# Altium schematic sheet U_LEDs_I2C_PORT.SchDoc
size Tabloid; DocumentNumber: 9; SheetNumber: 9; SheetTotal: 11; SheetName: LEDs and I2C exp. connector; Size: 11x17; Sheet_Name: LEDs and I2C exp. connector
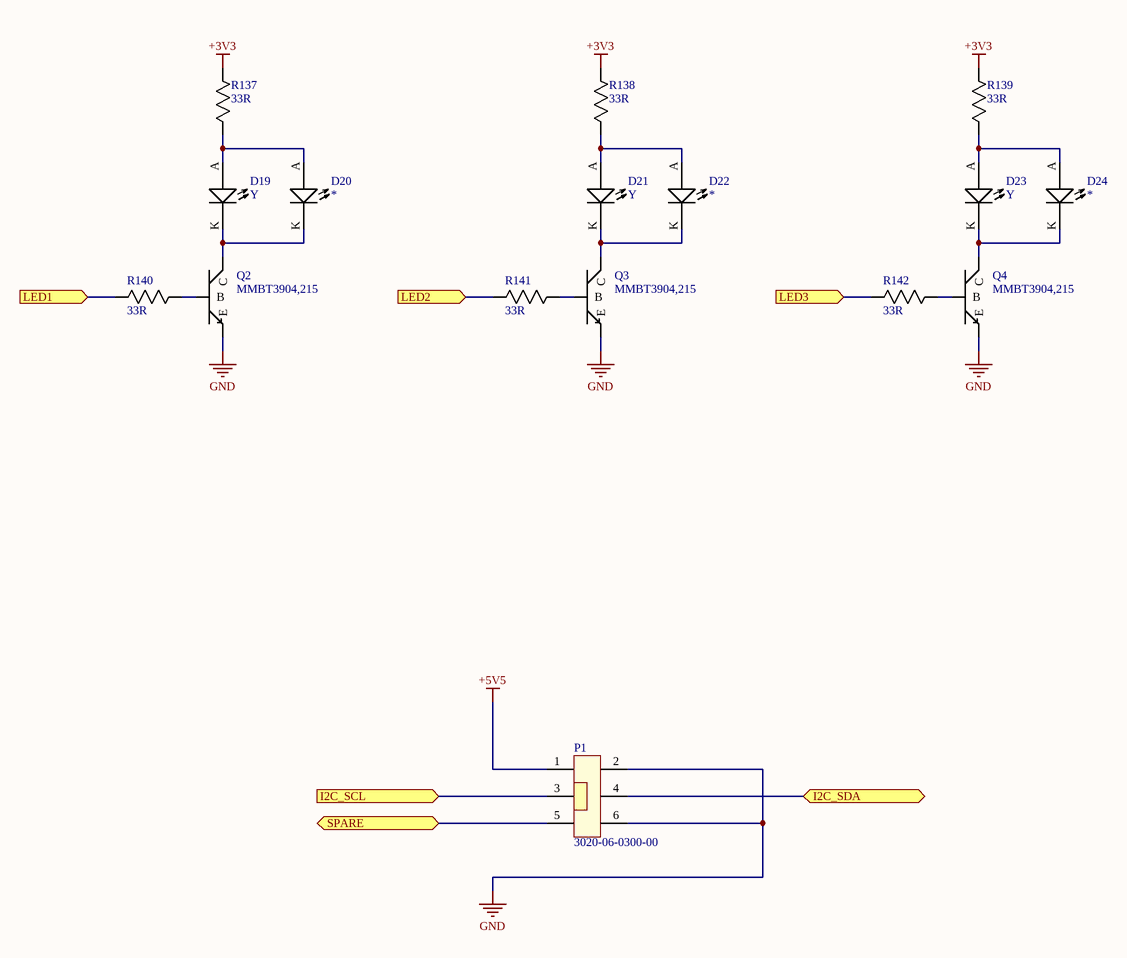
[diagram p0: U_LEDs_I2C_PORT.SchDoc]

## Parts
D19  Type: Y  [0805_LED]  (hidden comment: Diode_LED)
D20  Diode_LED  [0805_LED]  (value not drawn)
D21  Type: Y  [0805_LED]  (hidden comment: Diode_LED)
D22  Diode_LED  [0805_LED]  (value not drawn)
D23  Type: Y  [0805_LED]  (hidden comment: Diode_LED)
D24  Diode_LED  [0805_LED]  (value not drawn)
P1  Mfg_PN: 3020-06-0300-00  [CONN6_100mils_pol_SMD]  (hidden comment: CON6_3020-06-0300-00)
Q2  Mfg_PN: MMBT3904,215  [SOT23_GDS]  (hidden comment: BJT_N_GDS)
Q3  Mfg_PN: MMBT3904,215  [SOT23_GDS]  (hidden comment: BJT_N_GDS)
Q4  Mfg_PN: MMBT3904,215  [SOT23_GDS]  (hidden comment: BJT_N_GDS)
R137  value 33R  [0603]  (hidden comment: Resistor)
R138  value 33R  [0603]  (hidden comment: Resistor)
R139  value 33R  [0603]  (hidden comment: Resistor)
R140  value 33R  [0603]  (hidden comment: Resistor)
R141  value 33R  [0603]  (hidden comment: Resistor)
R142  value 33R  [0603]  (hidden comment: Resistor)

## Ports
I2C_SCL (in), I2C_SDA (bidir), LED1 (in), LED2 (in), LED3 (in), SPARE (bidir)

## Nets
+3V3: R137.2 R138.2 R139.2
+5V5: P1.1
GND: P1.2 P1.6 Q2.S(E) Q3.S(E) Q4.S(E)
I2C_SCL: P1.3 ; port I2C_SCL
I2C_SDA: P1.4 ; port I2C_SDA
LED1: R140.1 ; port LED1
LED2: R141.1 ; port LED2
LED3: R142.1 ; port LED3
SPARE: P1.5 ; port SPARE
NetD19_A: D19.A D20.A R137.1
NetD19_K: D19.K D20.K Q2.D(C)
NetD21_A: D21.A D22.A R138.1
NetD21_K: D21.K D22.K Q3.D(C)
NetD23_A: D23.A D24.A R139.1
NetD23_K: D23.K D24.K Q4.D(C)
NetQ2_G: Q2.G(B) R140.2
NetQ3_G: Q3.G(B) R141.2
NetQ4_G: Q4.G(B) R142.2

## Notes on the sheet
- Sheet Name
- Project Title
- Size
- Group
- Revision
- Date :
- Filename :
- Sheet
- Authors :
- of

## Library data of the parts
D19 D21 D23 = Diode_LED: LED; Mfg: Osram; Mfg_PN: LY R976-PS-36; HelpURL: *; NI: *; Supplier1: Digikey; Supplier1_PN: 475-2560-1-ND; Tolerance: *; Rating: *; Value: *
D20 D22 D24 = Diode_LED: LED; Mfg: Osram; Mfg_PN: LY R976-PS-36; Type: Y; HelpURL: *; NI: *; Supplier1: Digikey; Supplier1_PN: 475-2560-1-ND; Tolerance: *; Rating: *; Value: *
P1 = CON6_3020-06-0300-00: 6-pins; Mfg: Harwin; HelpURL: *; NI: *; Rating: *; Supplier1: Digikey; Supplier1_PN: 3020-06-0300-00-ND; Tolerance: *; Type: *; Value: *
Q2-Q4 = BJT_N_GDS: BJT NPN; Mfg: NXP; HelpURL: *; NI: *; Rating: *; Supplier1: Digikey; Supplier1_PN: 568-4510-1-ND; Tolerance: *; Type: *; Value: *
R137-R142 = Resistor: Mfg: Yageo; Mfg_PN: RC0603JR-0733RL; HelpURL: *; NI: *; Supplier1: Digikey; Supplier1_PN: 311-33GRCT-ND; Type: *; Rating: *; Tolerance: *